# Altium project STguitar.PrjPcb (part 2 of 2)
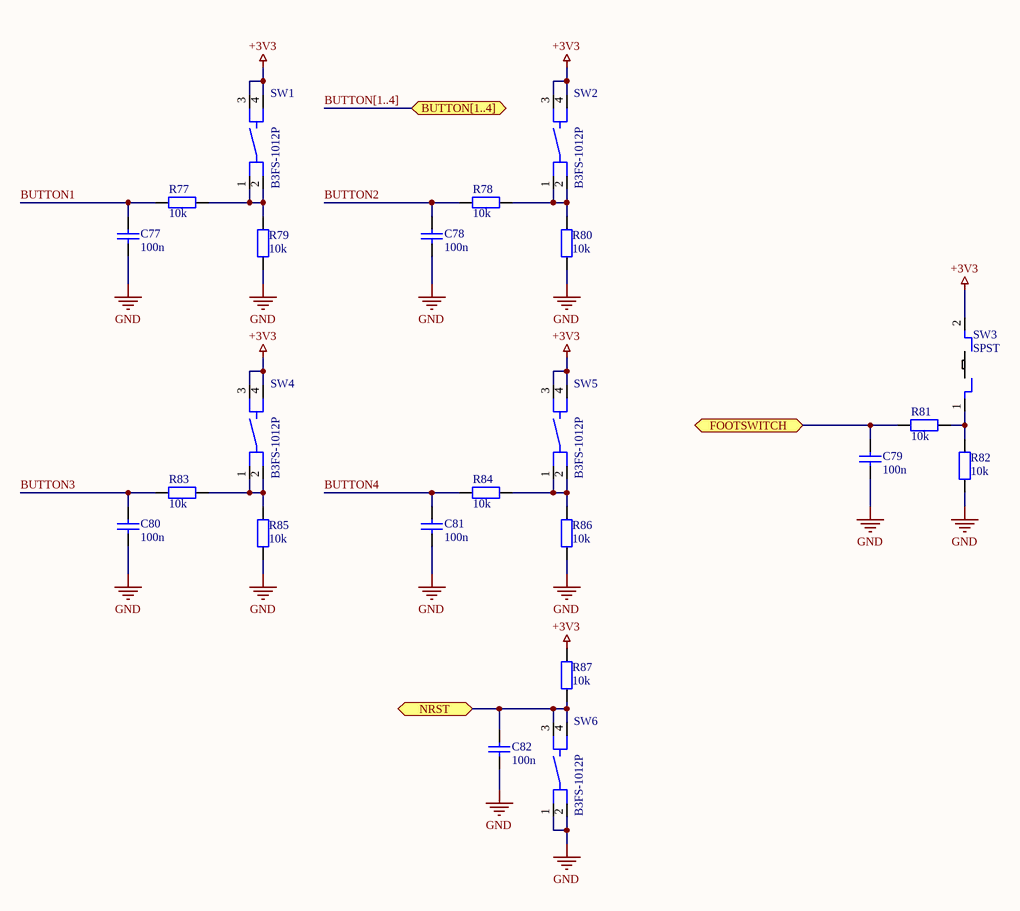
[diagram p11: [10] BUTTONS.SchDoc]

## Nets that join several sheets
+3V3: [1] PSU (F2.2 R3.2), [2] MCU (6 pins), [3] ADC (6 pins), [4] DAC (C45.2 L4.1), [5] SDRAM (26 pins), [6] QSPI (C70.2 R48.2 U6.8), [7] LCD (9 pins), [8] USB (R52.2), [9] EXTRAS (13 pins), [10] BUTTONS (10 pins)
GND: [0] TOP (MP1.0 MP2.0 MP3.0 MP4.0), [1] PSU (10 pins), [2] MCU (44 pins), [3] ADC (21 pins), [4] DAC (18 pins), [5] SDRAM (44 pins), [6] QSPI (C70.1 U6.4), [7] LCD (14 pins), [8] USB (J6.5 R54.1 R55.2 T1.3), [9] EXTRAS (23 pins), [10] BUTTONS (13 pins)
BUTTON1: [2] MCU (U2.167), [10] BUTTONS (C77.2 R77.2)
BUTTON2: [2] MCU (U2.168), [10] BUTTONS (C78.2 R78.2)
BUTTON3: [2] MCU (U2.169), [10] BUTTONS (C80.2 R83.2)
BUTTON4: [2] MCU (U2.172), [10] BUTTONS (C81.2 R84.2)
DCMI.NRST: [2] MCU (R12.1 U2.34), [10] BUTTONS (C82.2 R87.1 SW6.3 SW6.4)
FMC_A0: [2] MCU (U2.16), [5] SDRAM (U5.25)
FMC_A1: [2] MCU (U2.17), [5] SDRAM (U5.26)
FMC_A2: [2] MCU (U2.18), [5] SDRAM (U5.27)
FMC_A3: [2] MCU (U2.22), [5] SDRAM (U5.60)
FMC_A4: [2] MCU (U2.23), [5] SDRAM (U5.61)
FMC_A5: [2] MCU (U2.24), [5] SDRAM (U5.62)
FMC_A6: [2] MCU (U2.71), [5] SDRAM (U5.63)
FMC_A7: [2] MCU (U2.74), [5] SDRAM (U5.64)
FMC_A8: [2] MCU (U2.75), [5] SDRAM (U5.65)
FMC_A9: [2] MCU (U2.76), [5] SDRAM (U5.66)
FMC_A10: [2] MCU (U2.77), [5] SDRAM (U5.24)
FMC_A11: [2] MCU (U2.78), [5] SDRAM (U5.21)
FMC_BA0: [2] MCU (U2.131), [5] SDRAM (U5.22)
FMC_BA1: [2] MCU (U2.132), [5] SDRAM (U5.23)
FMC_D0: [2] MCU (U2.116), [5] SDRAM (U5.2)
FMC_D1: [2] MCU (U2.117), [5] SDRAM (U5.4)
FMC_D2: [2] MCU (U2.164), [5] SDRAM (U5.5)
FMC_D3: [2] MCU (U2.165), [5] SDRAM (U5.7)
FMC_D4: [2] MCU (U2.79), [5] SDRAM (U5.8)
FMC_D5: [2] MCU (U2.80), [5] SDRAM (U5.10)
FMC_D6: [2] MCU (U2.81), [5] SDRAM (U5.11)
FMC_D7: [2] MCU (U2.84), [5] SDRAM (U5.13)
FMC_D8: [2] MCU (U2.85), [5] SDRAM (U5.74)
FMC_D9: [2] MCU (U2.86), [5] SDRAM (U5.76)
FMC_D10: [2] MCU (U2.87), [5] SDRAM (U5.77)
FMC_D11: [2] MCU (U2.88), [5] SDRAM (U5.79)
FMC_D12: [2] MCU (U2.89), [5] SDRAM (U5.80)
FMC_D13: [2] MCU (U2.108), [5] SDRAM (U5.82)
FMC_D14: [2] MCU (U2.109), [5] SDRAM (U5.83)
FMC_D15: [2] MCU (U2.110), [5] SDRAM (U5.85)
FMC_NBL0: [2] MCU (U2.200), [5] SDRAM (U5.16)
FMC_NBL1: [2] MCU (U2.201), [5] SDRAM (U5.71)
FOOTSWITCH: [2] MCU (U2.105), [10] BUTTONS (C79.2 R81.2)
LCD_B0: [2] MCU (U2.3), [7] LCD (P1.21)
LCD_B1: [2] MCU (U2.175), [7] LCD (P1.22)
LCD_B2: [2] MCU (U2.176), [7] LCD (P1.23)
LCD_B3: [2] MCU (U2.177), [7] LCD (P1.24)
LCD_B4: [2] MCU (U2.181), [7] LCD (P1.25)
LCD_B5: [2] MCU (U2.187), [7] LCD (P1.26)
LCD_B6: [2] MCU (U2.188), [7] LCD (P1.27)
LCD_B7: [2] MCU (U2.189), [7] LCD (P1.28)
LCD_G0: [2] MCU (U2.119), [7] LCD (P1.13)
LCD_G1: [2] MCU (U2.120), [7] LCD (P1.14)
LCD_G2: [2] MCU (U2.121), [7] LCD (P1.15)
LCD_G3: [2] MCU (U2.122), [7] LCD (P1.16)
LCD_G4: [2] MCU (U2.123), [7] LCD (P1.17)
LCD_G5: [2] MCU (U2.126), [7] LCD (P1.18)
LCD_G6: [2] MCU (U2.127), [7] LCD (P1.19)
LCD_G7: [2] MCU (U2.128), [7] LCD (P1.20)
LCD_R0: [2] MCU (U2.64), [7] LCD (P1.5)
LCD_R1: [2] MCU (U2.65), [7] LCD (P1.6)
LCD_R2: [2] MCU (U2.66), [7] LCD (P1.7)
LCD_R3: [2] MCU (U2.67), [7] LCD (P1.8)
LCD_R4: [2] MCU (U2.68), [7] LCD (P1.9)
LCD_R5: [2] MCU (U2.69), [7] LCD (P1.10)
LCD_R6: [2] MCU (U2.95), [7] LCD (P1.11)
LCD_R7: [2] MCU (U2.118), [7] LCD (P1.12)
LED_B: [2] MCU (U2.54), [9] EXTRAS (R61.2)
LED_G: [2] MCU (U2.142), [9] EXTRAS (R67.2)
LED_R: [2] MCU (U2.55), [9] EXTRAS (R74.2)
POT1: [2] MCU (U2.27), [9] EXTRAS (R60.1)
POT2: [2] MCU (U2.28), [9] EXTRAS (R64.1)
POT3: [2] MCU (U2.29), [9] EXTRAS (R73.1)
POT4: [2] MCU (U2.30), [9] EXTRAS (R76.1)